# Altium schematic sheet P-TK-05-2FC-A-MB(V1.1)-20171225.SchDoc
size A2; SheetNumber: 0; SheetTotal: 0
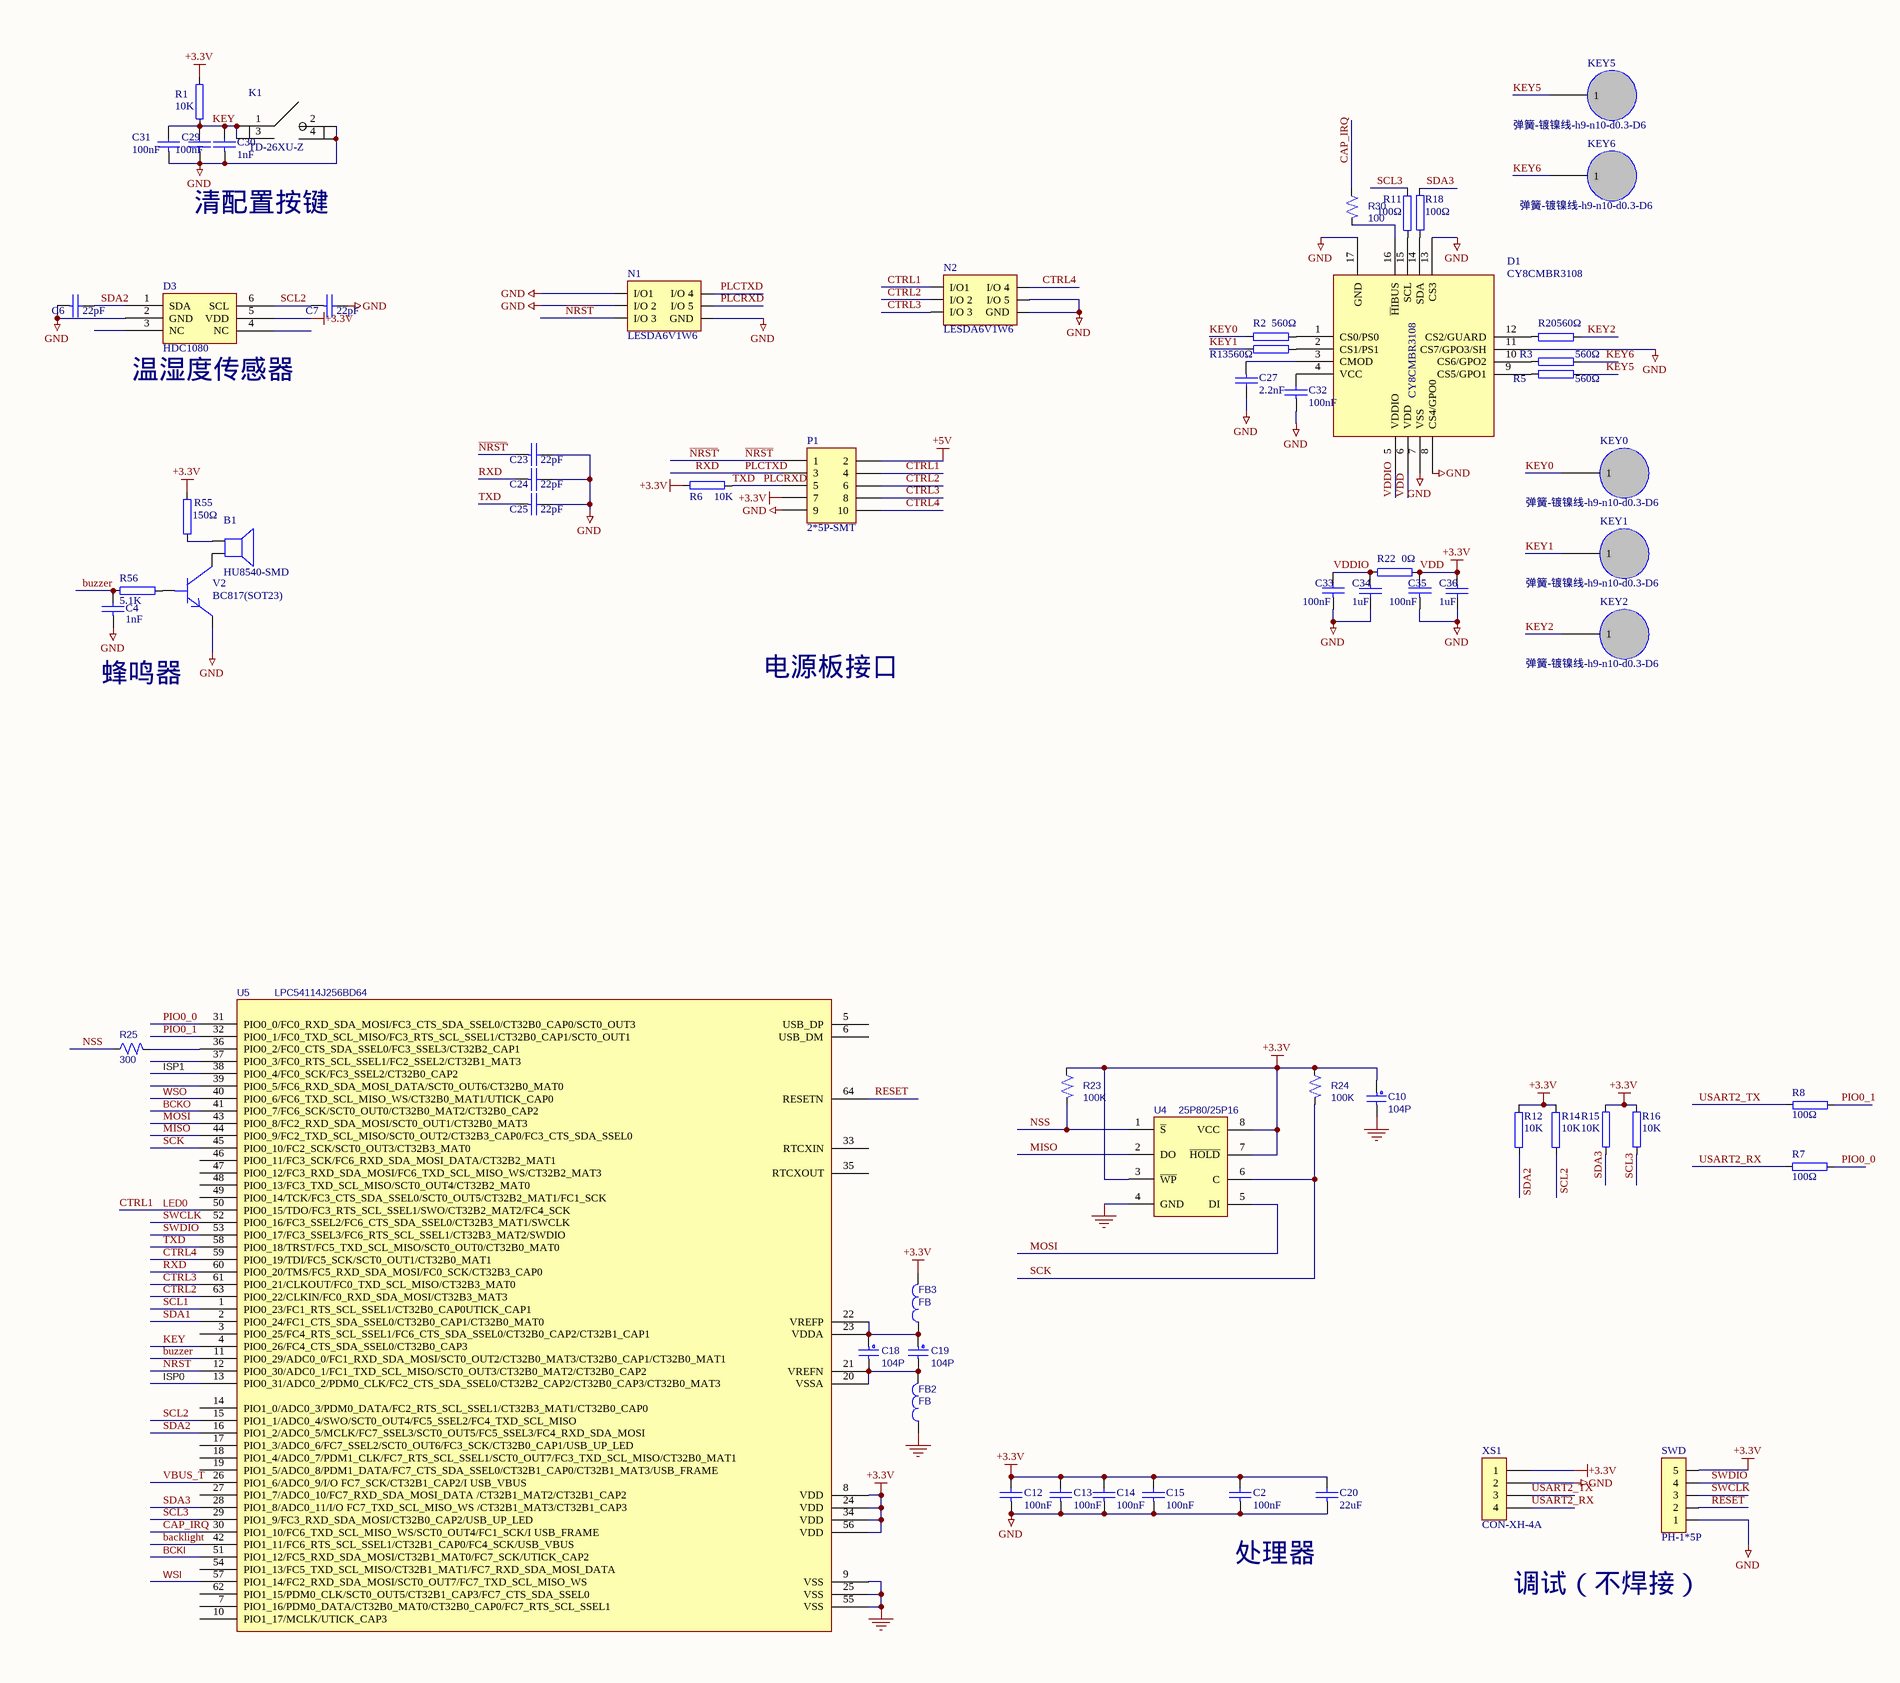
[diagram p0: P-TK-05-2FC-A-MB(V1.1)-20171225.SchDoc, left]
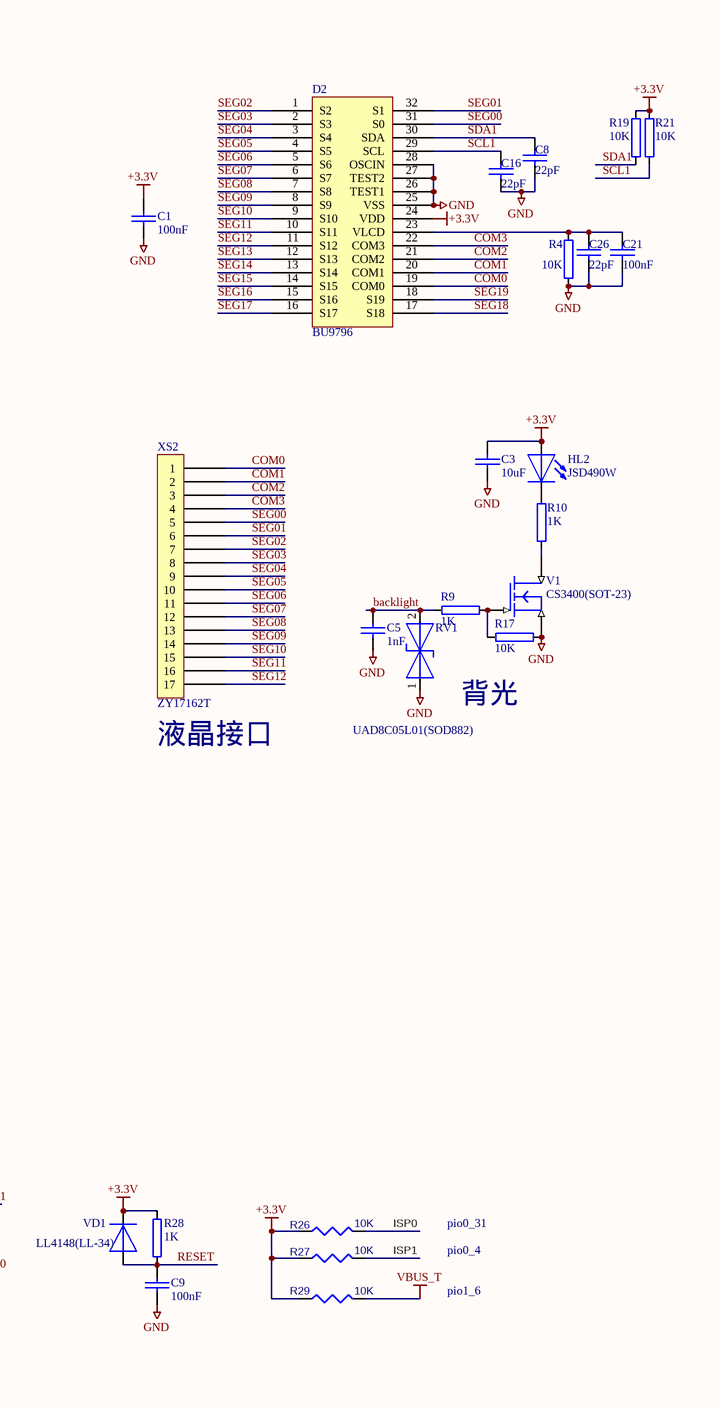
[diagram p1: P-TK-05-2FC-A-MB(V1.1)-20171225.SchDoc, right]

## Parts
B1  HU8540-SMD  [HU8540]
C1  100nF  [C0402]
C2  100nF  [0603C]
C3  10uF  [C0603]
C4  1nF  [0603C]
C5  1nF  [0603C]
C6  22pF  [C0603]
C7  22pF  [C0603]
C8  22pF  [C0603]
C9  100nF  [0603C]
C10  104P  [0603C]
C12  100nF  [0603C]
C13  100nF  [0603C]
C14  100nF  [0603C]
C15  100nF  [0603C]
C16  22pF  [C0603]
C18  104P  [0603C]
C19  104P  [0603C]
C20  22uF  [0603C]
C21  100nF  [0603C]
C23  22pF  [C0603]
C24  22pF  [C0603]
C25  22pF  [C0603]
C26  22pF  [C0603]
C27  2.2nF  [C0603]
C29  100nF  [0603C]
C30  1nF  [0603C]
C31  100nF  [0603C]
C32  100nF  [C0402]
C33  100nF  [C0402]
C34  1uF  [C0603]
C35  100nF  [C0402]
C36  1uF  [C0603]
D1  CY8CMBR3108  [QFN16 - 3108]
D2  BU9796  [SSOP-32]
D3  HDC1080  [DFN6-1]
FB2  FB  [0603L]
FB3  FB  [0603L]
HL2  JSD490W  [JSD490W-K]
K1  TD-26XU-Z  [TD-26XU-Z]
KEY0  弹簧-镀镍线-h9-n10-d0.3-D6  [SPRING]
KEY1  弹簧-镀镍线-h9-n10-d0.3-D6  [SPRING]
KEY2  弹簧-镀镍线-h9-n10-d0.3-D6  [SPRING]
KEY5  弹簧-镀镍线-h9-n10-d0.3-D6  [SPRING]
KEY6  弹簧-镀镍线-h9-n10-d0.3-D6  [SPRING]
N1  LESDA6V1W6  [SOT323-6L]
N2  LESDA6V1W6  [SOT323-6L]
P1  2*5P-SMT  [2*5  2.54 smt]
R1  10K  [0603R]
R2  560Ω  [R0603]
R3  560Ω  [R0603]
R4  10K  [0603R]
R5  560Ω  [R0603]
R6  10K  [0603R]
R7  100Ω  [0603R]
R8  100Ω  [0603R]
R9  1K  [0603R]
R10  1K  [R0805]
R11  100Ω  [0603R]
R12  10K  [0603R]
R13  560Ω  [R0603]
R14  10K  [0603R]
R15  10K  [0603R]
R16  10K  [0603R]
R17  10K  [0603R]
R18  100Ω  [0603R]
R19  10K  [0603R]
R20  560Ω  [R0603]
R21  10K  [0603R]
R22  0Ω  [R0603]
R23  100K  [0603R]
R24  100K  [0603R]
R25  300  [0603R]
R26  10K  [0603R]
R27  10K  [0603R]
R28  1K  [0603R]
R29  10K  [0603R]
R30  100  [0603R]
R55  150Ω  [R0603]
R56  5.1K  [R0603]
RV1  UAD8C05L01(SOD882)  [SOD-882]
SWD  PH-1*5P  [SIP5]
U4  25P80/25P16  [SO8W]
U5  LPC54114J256BD64  [LQFP64]
V1  CS3400(SOT-23)  [SOT-23-MOS]
V2  BC817(SOT23)  [SOT-23]
VD1  LL4148(LL-34)  [LL-34]
XS1  CON-XH-4A  [SIP4]
XS2  ZY17162T  [ZY17162T]

## Nets
+5V: P1.2
GND: C1.1 C2.1 C3.1 C4.1 C5.1 C6.1 C7.2 C8.1 C9.1 C10.2 C12.1 C13.1 C14.1 C15.1 C16.1 C20.1 C21.1 C23.2 C24.2 C25.2 C26.1 C27.2 C29.1 C30.1 C31.1 C32.1 C33.1 C34.2 C35.1 C36.2 D1.7(VSS) D1.8(CS4/GPO0) D1.11(CS7/GPO3/SH) D1.13(CS3) D1.17(GND) D2.25(VSS) D2.26(TEST1) D2.27(TEST2) D2.28(OSCIN) D3.2(GND) FB2.1 K1.2 K1.4 N1.1(I/O1) N1.2(GND) N1.3(I/O_2) N2.2(GND) N2.6(I/O_5) P1.9 R4.1 R17.1 RV1.1 SWD.1 U4.4(GND) U5.9(VSS) U5.25(VSS) U5.55(VSS) V1.S V2.E XS1.2
VBUS_T: R29.2 U5.26(PIO1_6/ADC0_9/I/O_FC7_SCK/CT32B1_CAP2/I_USB_VBUS)
VDD: C1.2 C2.2 C3.2 C10.1 C12.2 C13.2 C14.2 C15.2 C20.2 C35.2 C36.1 D1.6(VDD) D2.24(VDD) D3.5(VDD) FB3.2 HL2.A P1.7 R1.2 R6.2 R12.2 R14.2 R15.1 R16.1 R19.1 R21.1 R22.1 R23.1 R24.1 R26.1 R27.1 R28.1 R29.1 R55.2 SWD.5 U4.3(~{WP}) U4.7(~{HOLD}) U4.8(VCC) U5.8(VDD) U5.24(VDD) U5.34(VDD) U5.56(VDD) VD1.K XS1.1  [also labelled +3.3V]
backlight: C5.2 R9.1 RV1.2 U5.42(PIO1_11/FC6_RTS_SCL_SSEL1/CT32B1_CAP0/FC4_SCK/USB_VBUS)
BCKI: U5.51(PIO1_12/FC5_RXD_SDA_MOSI/CT32B1_MAT0/FC7_SCK/UTICK_CAP2)
BCKO: U5.41(PIO0_7/FC6_SCK/SCT0_OUT0/CT32B0_MAT2/CT32B0_CAP2)
buzzer: C4.2 R56.2 U5.11(PIO0_29/ADC0_0/FC1_RXD_SDA_MOSI/SCT0_OUT2/CT32B0_MAT3/CT32B0_CAP1/CT32B0_MAT1)
CAP_IRQ: R30.1 U5.30(PIO1_10/FC6_TXD_SCL_MISO_WS/SCT0_OUT4/FC1_SCK/I_USB_FRAME)
COM0: D2.19(COM0) XS2.1
COM1: D2.20(COM1) XS2.2
COM2: D2.21(COM2) XS2.3
COM3: D2.22(COM3) XS2.4
CTRL1: N2.1(I/O1) P1.4 U5.50(PIO0_15/TDO/FC3_RTS_SCL_SSEL1/SWO/CT32B2_MAT2/FC4_SCK)  [also labelled LED0]
CTRL2: N2.3(I/O_2) P1.6 U5.63(PIO0_22/CLKIN/FC0_RXD_SDA_MOSI/CT32B3_MAT3)
CTRL3: N2.4(I/O_3) P1.8 U5.61(PIO0_21/CLKOUT/FC0_TXD_SCL_MISO/CT32B3_MAT0)
CTRL4: N2.5(I/O_4) P1.10 U5.59(PIO0_19/TDI/FC5_SCK/SCT0_OUT1/CT32B0_MAT1)
ISP0: R26.2 U5.13(PIO0_31/ADC0_2/PDM0_CLK/FC2_CTS_SDA_SSEL0/CT32B2_CAP2/CT32B0_CAP3/CT32B0_MAT3)
ISP1: R27.2 U5.38(PIO0_4/FC0_SCK/FC3_SSEL2/CT32B0_CAP2)
KEY: C29.2 C30.2 C31.2 K1.1 K1.3 R1.1 U5.4(PIO0_26/FC4_CTS_SDA_SSEL0/CT32B0_CAP3)
KEY0: KEY0.1 R2.2
KEY1: KEY1.1 R13.2
KEY2: KEY2.1 R20.2
KEY5: KEY5.1 R5.2
KEY6: KEY6.1 R3.2
MISO: U4.2(DO) U5.44(PIO0_9/FC2_TXD_SCL_MISO/SCT0_OUT2/CT32B3_CAP0/FC3_CTS_SDA_SSEL0)
MOSI: U4.5(DI) U5.43(PIO0_8/FC2_RXD_SDA_MOSI/SCT0_OUT1/CT32B0_MAT3)
~{NRST}: C23.1 N1.4(I/O_3) P1.1 U5.12(PIO0_30/ADC0_1/FC1_TXD_SCL_MISO/SCT0_OUT3/CT32B0_MAT2/CT32B0_CAP2)  [also labelled ~{NRST}']
NSS: R23.2 R25.1 U4.1(~{S})
PIO0_0: R7.1 U5.31(PIO0_0/FC0_RXD_SDA_MOSI/FC3_CTS_SDA_SSEL0/CT32B0_CAP0/SCT0_OUT3)
PIO0_1: R8.2 U5.32(PIO0_1/FC0_TXD_SCL_MISO/FC3_RTS_SCL_SSEL1/CT32B0_CAP1/SCT0_OUT1)
PLCRXD: C25.1 N1.6(I/O_5) P1.5 R6.1 U5.58(PIO0_18/TRST/FC5_TXD_SCL_MISO/SCT0_OUT0/CT32B0_MAT0)  [also labelled TXD]
PLCTXD: C24.1 N1.5(I/O_4) P1.3 U5.60(PIO0_20/TMS/FC5_RXD_SDA_MOSI/FC0_SCK/CT32B3_CAP0)  [also labelled RXD]
RESET: C9.2 R28.2 SWD.2 U5.64(RESETN) VD1.A
SCK: R24.2 U4.6(C) U5.45(PIO0_10/FC2_SCK/SCT0_OUT3/CT32B3_MAT0)
SCL1: C16.2 D2.29(SCL) R21.2 U5.1(PIO0_23/FC1_RTS_SCL_SSEL1/CT32B0_CAP0UTICK_CAP1)
SCL2: C7.1 D3.6(SCL) R14.1 U5.15(PIO1_1/ADC0_4/SWO/SCT0_OUT4/FC5_SSEL2/FC4_TXD_SCL_MISO)
SCL3: R11.2 R16.2 U5.29(PIO1_9/FC3_RXD_SDA_MOSI/CT32B0_CAP2/USB_UP_LED)
SDA1: C8.2 D2.30(SDA) R19.2 U5.2(PIO0_24/FC1_CTS_SDA_SSEL0/CT32B0_CAP1/CT32B0_MAT0)
SDA2: C6.2 D3.1(SDA) R12.1 U5.16(PIO1_2/ADC0_5/MCLK/FC7_SSEL3/SCT0_OUT5/FC5_SSEL3/FC4_RXD_SDA_MOSI)
SDA3: R15.2 R18.1 U5.28(PIO1_8/ADC0_11/I/O_FC7_TXD_SCL_MISO_WS_/CT32B1_MAT3/CT32B1_CAP3)
SEG00: D2.31(S0) XS2.5
SEG01: D2.32(S1) XS2.6
SEG02: D2.1(S2) XS2.7
SEG03: D2.2(S3) XS2.8
SEG04: D2.3(S4) XS2.9
SEG05: D2.4(S5) XS2.10
SEG06: D2.5(S6) XS2.11
SEG07: D2.6(S7) XS2.12
SEG08: D2.7(S8) XS2.13
SEG09: D2.8(S9) XS2.14
SEG10: D2.9(S10) XS2.15
SEG11: D2.10(S11) XS2.16
SEG12: D2.11(S12) XS2.17
SEG13: D2.12(S13)
SEG14: D2.13(S14)
SEG15: D2.14(S15)
SEG16: D2.15(S16)
SEG17: D2.16(S17)
SEG18: D2.17(S18)
SEG19: D2.18(S19)
SWCLK: SWD.3 U5.52(PIO0_16/FC3_SSEL2/FC6_CTS_SDA_SSEL0/CT32B3_MAT1/SWCLK)
SWDIO: SWD.4 U5.53(PIO0_17/FC3_SSEL3/FC6_RTS_SCL_SSEL1/CT32B3_MAT2/SWDIO)
USART2_RX: R7.2 XS1.4
USART2_TX: R8.1 XS1.3
VDDIO: C33.2 C34.1 D1.5(VDDIO) R22.2
WSI: U5.57(PIO1_14/FC2_RXD_SDA_MOSI/SCT0_OUT7/FC7_TXD_SCL_MISO_WS)
WSO: U5.40(PIO0_6/FC6_TXD_SCL_MISO_WS/CT32B0_MAT1/UTICK_CAP0)
NetB1_1: B1.1 R55.1
NetB1_2: B1.2 V2.C
NetC18_1: C18.1 C19.1 FB3.1 U5.22(VREFP) U5.23(VDDA)
NetC18_2: C18.2 C19.2 FB2.2 U5.20(VSSA) U5.21(VREFN)
NetC21_2: C21.2 C26.2 D2.23(VLCD) R4.2
NetC27_1: C27.1 D1.3(CMOD)
NetC32_2: C32.2 D1.4(VCC)
NetD1_1: D1.1(CS0/PS0) R2.1
NetD1_2: D1.2(CS1/PS1) R13.1
NetD1_9: D1.9(CS5/GPO1) R5.1
NetD1_10: D1.10(CS6/GPO2) R3.1
NetD1_12: D1.12(CS2/GUARD) R20.1
NetD1_14: D1.14(SDA) R18.2
NetD1_15: D1.15(SCL) R11.1
NetD1_16: D1.16(~{H}IBUS) R30.2
NetHL2_K: HL2.K R10.2
NetR9_2: R9.2 R17.2 V1.G
NetR10_1: R10.1 V1.D
NetR25_2: R25.2 U5.36(PIO0_2/FC0_CTS_SDA_SSEL0/FC3_SSEL3/CT32B2_CAP1)
NetR56_1: R56.1 V2.B

Not connected (* = marked no-connect by the designer): D3 3(NC) 4(NC); U5 3(PIO0_25/FC4_RTS_SCL_SSEL1/FC6_CTS_SDA_SSEL0/CT32B0_CAP2/CT32B1_CAP1) 5(USB_DP) 6(USB_DM) 7(PIO1_16/PDM0_DATA/CT32B0_MAT0/CT32B0_CAP0/FC7_RTS_SCL_SSEL1) 10(PIO1_17/MCLK/UTICK_CAP3) 14(PIO1_0/ADC0_3/PDM0_DATA/FC2_RTS_SCL_SSEL1/CT32B3_MAT1/CT32B0_CAP0) 17(PIO1_3/ADC0_6/FC7_SSEL2/SCT0_OUT6/FC3_SCK/CT32B0_CAP1/USB_UP_LED) 18(PIO1_4/ADC0_7/PDM1_CLK/FC7_RTS_SCL_SSEL1/SCT0_OUT7/FC3_TXD_SCL_MISO/CT32B0_MAT1) 19(PIO1_5/ADC0_8/PDM1_DATA/FC7_CTS_SDA_SSEL0/CT32B1_CAP0/CT32B1_MAT3/USB_FRAME) 27(PIO1_7/ADC0_10/FC7_RXD_SDA_MOSI_DATA_/CT32B1_MAT2/CT32B1_CAP2) 33(RTCXIN) 35(RTCXOUT) 37(PIO0_3/FC0_RTS_SCL_SSEL1/FC2_SSEL2/CT32B1_MAT3) 39(PIO0_5/FC6_RXD_SDA_MOSI_DATA/SCT0_OUT6/CT32B0_MAT0) 46(PIO0_11/FC3_SCK/FC6_RXD_SDA_MOSI_DATA/CT32B2_MAT1) 47(PIO0_12/FC3_RXD_SDA_MOSI/FC6_TXD_SCL_MISO_WS/CT32B2_MAT3) 48(PIO0_13/FC3_TXD_SCL_MISO/SCT0_OUT4/CT32B2_MAT0) 49(PIO0_14/TCK/FC3_CTS_SDA_SSEL0/SCT0_OUT5/CT32B2_MAT1/FC1_SCK) 54(PIO1_13/FC5_TXD_SCL_MISO/CT32B1_MAT1/FC7_RXD_SDA_MOSI_DATA) 62(PIO1_15/PDM0_CLK/SCT0_OUT5/CT32B1_CAP3/FC7_CTS_SDA_SSEL0)

## Notes on the sheet
- 清配置按键
- (near D3) 温湿度传感器
- 蜂鸣器
- 电源板接口
- (near XS2) 液晶接口
- 背光
- pio0_31
- pio0_4
- pio1_6
- (near C2) 处理器
- 调试（不焊接）

## Library data of the parts
B1 = 10112020002: 扬声器; Spec: LS-HU8540-SMD; Value: HU8540-SMD; Part Number: 10112020002; Name: 扬声器; Package Type: SMT; Part Type: 扬声器
C1 C2 C9 C12-C15 C21 C29 C31-C33 C35 = 10103020007: 无极性电容; Name: 0402贴片陶瓷电容; Spec: CC0402-K-100nF-16V; Value: 100nF; Part Number: 10103020007; Package Type: SMT; Part Type: 0402贴片陶瓷电容
C3 = 10103030010: 无极性电容; Name: 0603贴片陶瓷电容; Spec: CC0603-M-10uF-16V; Value: 10uF; Part Number: 10103030010; Package Type: SMT; Part Type: 0603贴片陶瓷电容
C4 C5 C30 = 10103020004: 无极性电容; Name: 0402贴片陶瓷电容; Spec: CC0402-K-1nF-25V; Value: 1nF; Part Number: 10103020004; Package Type: SMT; Part Type: 0402贴片陶瓷电容
C6-C8 C16 C23-C26 = 10103030023: 无极性电容; Name: 0603贴片陶瓷电容; Spec: CC0603-J-22pF; Value: 22pF; Part Number: 10103030023; Package Type: SMT; Part Type: 0603贴片陶瓷电容
C10 C18 C19 = CAP
  C18 C19: Part Field 2: Capacitor,MLCC; Part Field 4: Manley
C20 = 10103040014: 无极性电容; Name: 0805贴片陶瓷电容; Spec: CC0805-M-22uF-25V; Value: 22uF; Part Number: 10103040014; Package Type: SMT; Part Type: 0805贴片陶瓷电容
C27 = 10103030025: 无极性电容; Name: 0603贴片陶瓷电容; Spec: CC0603-J-2.2nF; Value: 2.2nF; Part Number: 10103030025; Package Type: SMT; Part Type: 0603贴片陶瓷电容
C34 C36 = 10103030008: 无极性电容; Name: 0603贴片陶瓷电容; Spec: CC0603-K-1uF-25V; Value: 1uF; Part Number: 10103030008; Package Type: SMT; Part Type: 0603贴片陶瓷电容
D1 = 10109010004: 微控制器; Name: MCU; Spec: IC-MCU-CY8CMBR3108-QFN16; Value: CY8CMBR3108; Part Number: 10109010004; Package Type: SMT; Part Type: MCU
D2 = 10109140005: Name: 系统管理; Value: BU9796AFS; Spec: IC-SM-BU9796AFS-SSOP32; Part Number: 10109140005; Part Type: 系统管理芯片
D3 = 10117000017: 温湿度传感器; Value: HDC1080; Part Number: 10117000017; Name: 温湿度传感器; Spec: HDC1080; Package Type: SMT; Part Type: 传感器
HL2 = 10111040012: LED-发光管类; Name: 液晶背光板; Value: JSD490W; Part Number: 10111040012; Spec: JSD490W; Package Type: THT; Part Type: 液晶背光板
K1 = 10121000033: Name: 轻触开关; Spec: SWITCH-轻触开关-TD-26XU-Z(4.7X4.5X1.7)-SMD; Value: TD-26XU-Z; Part Number: 10121000033; Package Type: SMT; Part Type: 开关
KEY0-KEY2 KEY5 KEY6 = 10302000003: 弹簧; Name: 防结露联网型温控器A弹簧; VALUE: 弹簧-镀镍线-h9-n10-d0.3-D6; Part Number: 10302000003; Spec: 弹簧-镀镍线-h9-n10-d0.3-D6; Package Type: THT; Part Type: 弹簧
N1 N2 = 10109090005: IC-其它类集成电路; Name: ESD防护; Spec: IC-ESD-LESDA6V1W6-SOT323-6L; Value: LESDA6V1W6; Part Number: 10109090005; Part Type: ESD防护
P1 = 10118020054: Name: 排母; Spec: FH-2*5P:2.54/PB7.1/W7.1/U型/SMD/PA6T/带柱; VALUE: 2*5P-SMT; 供应商e: *; 器件类型: *; Value: *; Part Number: 10118020054; Package Type: SMT; Part Type: 排母
R1 R4 R6 R12 R14-R17 R19 R21 = 10102010006: 电阻; Name: 0402贴片电阻; Spec: RC0402-F-10K; VALUE: 10K; Value: *; Part Number: 10102010006; Package Type: SMT; Part Type: 0402贴片电阻
R2 R3 R5 R13 R20 = 10102020127: 电阻; Name: 0603贴片电阻; Spec: RC0603-J-560Ω; VALUE: 560Ω; Value: *; Part Number: 10102020127; Package Type: SMT; Part Type: 0603贴片电阻
R7 R8 = 10102010003: @; Name: 0402贴片电阻; Spec: RC0402-F-100Ω; VALUE: 100Ω; Value: *; Part Number: 10102010003; Package Type: SMT; Part Type: 0402贴片电阻
R9 R28 = 10102010005: 电阻; Name: 0402贴片电阻; Spec: RC0402-F-1K; VALUE: 1K; Value: *; Part Number: 10102010005; Package Type: SMT; Part Type: 0402贴片电阻
R10 = 10102030005: 电阻; Name: 0805贴片电阻; Spec: RC0805-J-1K; VALUE: 1K; Value: *; Part Number: 10102030005; Package Type: SMT; Part Type: 0805贴片电阻
R11 R18 = 10102010003: 电阻; Name: 0402贴片电阻; Spec: RC0402-F-100Ω; VALUE: 100Ω; Value: *; Part Number: 10102010003; Package Type: SMT; Part Type: 0402贴片电阻
R22 = 10102020001: 电阻; Name: 0603贴片电阻; Spec: RC0603-J-0Ω; VALUE: 0Ω; Value: *; Part Number: 10102020001; Package Type: SMT; Part Type: 0603贴片电阻
R23-R25 R30 = RES3
R26 R27 R29 = RES1
R55 = 10102020026: 电阻; Name: 0603贴片电阻; Spec: RC0603-J-150Ω; VALUE: 150Ω; Value: *; Part Number: 10102020026; Package Type: SMT; Part Type: 0603贴片电阻
R56 = 10102020116: 电阻; Name: 0603贴片电阻; Spec: RC0603-J-5.1K; VALUE: 5.1K; Value: *; Part Number: 10102020116; Package Type: SMT; Part Type: 0603贴片电阻
RV1 = 10105050017: TVS-TVS管; Name: TVS管; Spec: TVS-6V-BI-UAD8C05L01(SOD-882); Value: UAD8C05L01(SOD882); Part Number: 10105050017; Package Type: SMT; Part Type: TVS管
SWD = 10118010013: @; Name: 排针; Spec: PH-1*5P-L8.5mm:2.54/PA3.0/PB2.5/PC3.0; Value: PH-1*5P; Part Number: 10118010013; Package Type: THT; Part Type: 排针
U4 = M25PXX(8)
U5 = LPC5411X_LQFP64: Text Field1: OriginalName LPC5411X_LQFP64; Text Field2: Description; Text Field3: Part Field 1; Text Field4: Part Field 2; Text Field5: Part Field 3; Text Field6: Part Field 4; Text Field7: Part Field 5; Text Field8: Part Field 6
V1 = 10107050002: N沟道绝缘栅场效应管_增强型; Name: MOS管; Spec: MOS-ehcN-30V-5.8A-CS3400(SOT-23); Value: CS3400(SOT-23); Part Number: 10107050002; Package Type: SMT; Part Type: MOS管
V2 = 10107010003: NPN三极管; Name: 普通三极管; Spec: BJT-NPN-50V-BC817(SOT-23); Value: BC817(SOT23); Part Number: 10107010003; Package Type: SMT; Part Type: 普通三极管
VD1 = 10105040022: DIODE-整流二极管类; Name: 肖特基二极管; Spec: DIODE-SCT-150mA-75V-LL4148(LL-34); Value: LL4148(LL-34); Part Number: 10105040022; Package Type: SMT; Part Type: 肖特基二极管
XS1 = 10118030031: @; Name: 针座; Spec: CON-XH4A:2.54/L; Value: CON-XH-4A; Part Number: 10118030031; Package Type: SMT; Part Type: 针座
XS2 = 10116020006: Name: 液晶; Value: ZY17162T; Part Number: 10116020006; Spec: ZY17162T; Package Type: THT; Part Type: 段式液晶